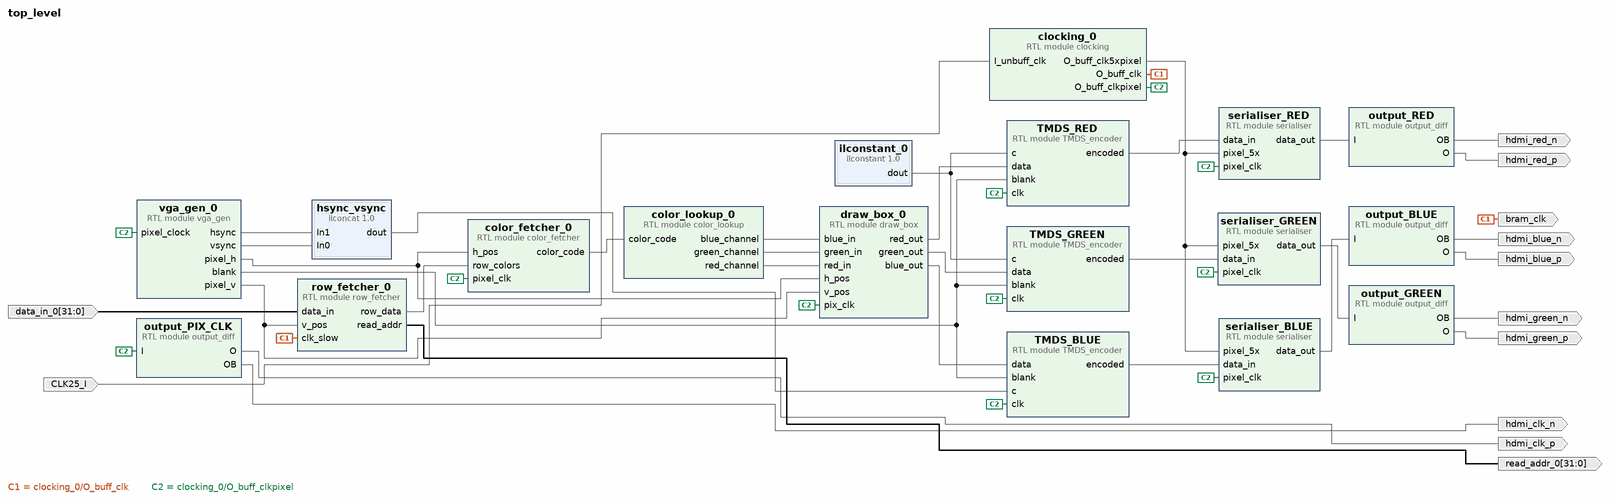
[diagram p0: block diagram of the top level]
# Vivado block design top_level, xc7s15ftgb196-1, Vivado 2025.2
create_bd_design top_level

create_bd_port -dir I -type clk CLK25_I
set_property -dict {CONFIG.FREQ_HZ 25000000} [get_bd_ports CLK25_I]
create_bd_port -dir O hdmi_clk_p
create_bd_port -dir O hdmi_clk_n
create_bd_port -dir O hdmi_red_n
create_bd_port -dir O hdmi_blue_p
create_bd_port -dir O hdmi_red_p
create_bd_port -dir O hdmi_green_n
create_bd_port -dir O hdmi_blue_n
create_bd_port -dir O hdmi_green_p
create_bd_port -dir O -from 31 -to 0 read_addr_0
create_bd_port -dir I -from 31 -to 0 data_in_0
create_bd_port -dir O bram_clk

create_bd_cell -type module -reference vga_gen vga_gen_0
set_property -dict [list \
  CONFIG.hEndSync 2052 \
  CONFIG.hMaxCount 2200 \
  CONFIG.hRez 1920 \
  CONFIG.hStartSync 2008 \
  CONFIG.vEndSync 1089 \
  CONFIG.vMaxCount 1125 \
  CONFIG.vRez 1080 \
  CONFIG.vStartSync 1084 \
] [get_bd_cells vga_gen_0]
create_bd_cell -type module -reference clocking clocking_0
set_property -dict {CONFIG.in_mul 30 CONFIG.pix5x_div 1 CONFIG.pix_div 5} [get_bd_cells clocking_0]
create_bd_cell -type module -reference serialiser serialiser_RED
create_bd_cell -type module -reference serialiser serialiser_GREEN
create_bd_cell -type module -reference serialiser serialiser_BLUE
create_bd_cell -type module -reference TMDS_encoder TMDS_RED
create_bd_cell -type module -reference TMDS_encoder TMDS_GREEN
create_bd_cell -type module -reference TMDS_encoder TMDS_BLUE
create_bd_cell -type inline_hdl -vlnv xilinx.com:inline_hdl:ilconcat:1.0 hsync_vsync
create_bd_cell -type inline_hdl -vlnv xilinx.com:inline_hdl:ilconstant:1.0 ilconstant_0
set_property -dict {CONFIG.CONST_VAL 0 CONFIG.CONST_WIDTH 2} [get_bd_cells ilconstant_0]
create_bd_cell -type module -reference output_diff output_RED
create_bd_cell -type module -reference output_diff output_GREEN
create_bd_cell -type module -reference output_diff output_BLUE
create_bd_cell -type module -reference output_diff output_PIX_CLK
create_bd_cell -type module -reference draw_box draw_box_0
create_bd_cell -type module -reference color_lookup color_lookup_0
create_bd_cell -type module -reference row_fetcher row_fetcher_0
create_bd_cell -type module -reference color_fetcher color_fetcher_0
set_property -dict {CONFIG.tetris_block_pixel_width 45} [get_bd_cells color_fetcher_0]

# ---- connections ----

connect_bd_net -net I_unbuff_clk_0_1 [get_bd_ports CLK25_I] [get_bd_pins clocking_0/I_unbuff_clk]
connect_bd_net [get_bd_pins TMDS_BLUE/encoded] [get_bd_pins serialiser_BLUE/data_in]
connect_bd_net [get_bd_pins TMDS_GREEN/encoded] [get_bd_pins serialiser_GREEN/data_in]
connect_bd_net [get_bd_pins TMDS_RED/encoded] [get_bd_pins serialiser_RED/data_in]
connect_bd_net [get_bd_pins clocking_0/O_buff_clk] [get_bd_pins row_fetcher_0/clk_slow] [get_bd_ports bram_clk]
connect_bd_net [get_bd_pins clocking_0/O_buff_clk5xpixel] \
  [get_bd_pins serialiser_RED/pixel_5x] [get_bd_pins serialiser_GREEN/pixel_5x] [get_bd_pins serialiser_BLUE/pixel_5x]
connect_bd_net [get_bd_pins clocking_0/O_buff_clkpixel] \
  [get_bd_pins vga_gen_0/pixel_clock] [get_bd_pins serialiser_RED/pixel_clk] [get_bd_pins serialiser_GREEN/pixel_clk] \
  [get_bd_pins serialiser_BLUE/pixel_clk] [get_bd_pins output_PIX_CLK/I] [get_bd_pins TMDS_RED/clk] \
  [get_bd_pins TMDS_GREEN/clk] [get_bd_pins TMDS_BLUE/clk] [get_bd_pins color_fetcher_0/pixel_clk] \
  [get_bd_pins draw_box_0/pix_clk]
connect_bd_net [get_bd_pins color_fetcher_0/color_code] [get_bd_pins color_lookup_0/color_code]
connect_bd_net [get_bd_pins color_lookup_0/blue_channel] [get_bd_pins draw_box_0/blue_in]
connect_bd_net [get_bd_pins color_lookup_0/green_channel] [get_bd_pins draw_box_0/green_in]
connect_bd_net [get_bd_pins color_lookup_0/red_channel] [get_bd_pins draw_box_0/red_in]
connect_bd_net -net data_in_0_1 [get_bd_ports data_in_0] [get_bd_pins row_fetcher_0/data_in]
connect_bd_net [get_bd_pins draw_box_0/blue_out] [get_bd_pins TMDS_BLUE/data]
connect_bd_net [get_bd_pins draw_box_0/green_out] [get_bd_pins TMDS_GREEN/data]
connect_bd_net [get_bd_pins draw_box_0/red_out] [get_bd_pins TMDS_RED/data]
connect_bd_net -net ilconcat_0_dout [get_bd_pins hsync_vsync/dout] [get_bd_pins TMDS_BLUE/c]
connect_bd_net [get_bd_pins ilconstant_0/dout] [get_bd_pins TMDS_RED/c] [get_bd_pins TMDS_GREEN/c]
connect_bd_net [get_bd_pins output_BLUE/O] [get_bd_ports hdmi_blue_p]
connect_bd_net [get_bd_pins output_BLUE/OB] [get_bd_ports hdmi_blue_n]
connect_bd_net [get_bd_pins output_GREEN/O] [get_bd_ports hdmi_green_p]
connect_bd_net [get_bd_pins output_GREEN/OB] [get_bd_ports hdmi_green_n]
connect_bd_net [get_bd_pins output_PIX_CLK/O] [get_bd_ports hdmi_clk_p]
connect_bd_net [get_bd_pins output_PIX_CLK/OB] [get_bd_ports hdmi_clk_n]
connect_bd_net [get_bd_pins output_RED/O] [get_bd_ports hdmi_red_p]
connect_bd_net [get_bd_pins output_RED/OB] [get_bd_ports hdmi_red_n]
connect_bd_net [get_bd_pins row_fetcher_0/read_addr] [get_bd_ports read_addr_0]
connect_bd_net [get_bd_pins row_fetcher_0/row_data] [get_bd_pins color_fetcher_0/row_colors]
connect_bd_net [get_bd_pins serialiser_BLUE/data_out] [get_bd_pins output_BLUE/I]
connect_bd_net [get_bd_pins serialiser_GREEN/data_out] [get_bd_pins output_GREEN/I]
connect_bd_net [get_bd_pins serialiser_RED/data_out] [get_bd_pins output_RED/I]
connect_bd_net [get_bd_pins vga_gen_0/blank] [get_bd_pins TMDS_RED/blank] [get_bd_pins TMDS_GREEN/blank] [get_bd_pins TMDS_BLUE/blank]
connect_bd_net [get_bd_pins vga_gen_0/hsync] [get_bd_pins hsync_vsync/In1]
connect_bd_net [get_bd_pins vga_gen_0/pixel_h] [get_bd_pins color_fetcher_0/h_pos] [get_bd_pins draw_box_0/h_pos]
connect_bd_net [get_bd_pins vga_gen_0/pixel_v] [get_bd_pins row_fetcher_0/v_pos] [get_bd_pins draw_box_0/v_pos]
connect_bd_net [get_bd_pins vga_gen_0/vsync] [get_bd_pins hsync_vsync/In0]

set_property USER_COMMENTS.comment_0 {Input clock: 25 MHz
clkpixel: 150 MHz
clk5xpixel: 750 MHz
buff_clk: 25 MHz} [current_bd_design]

validate_bd_design
save_bd_design
